# EAGLE design SparkFun Cellular Shield (EAGLE 7.1.0)
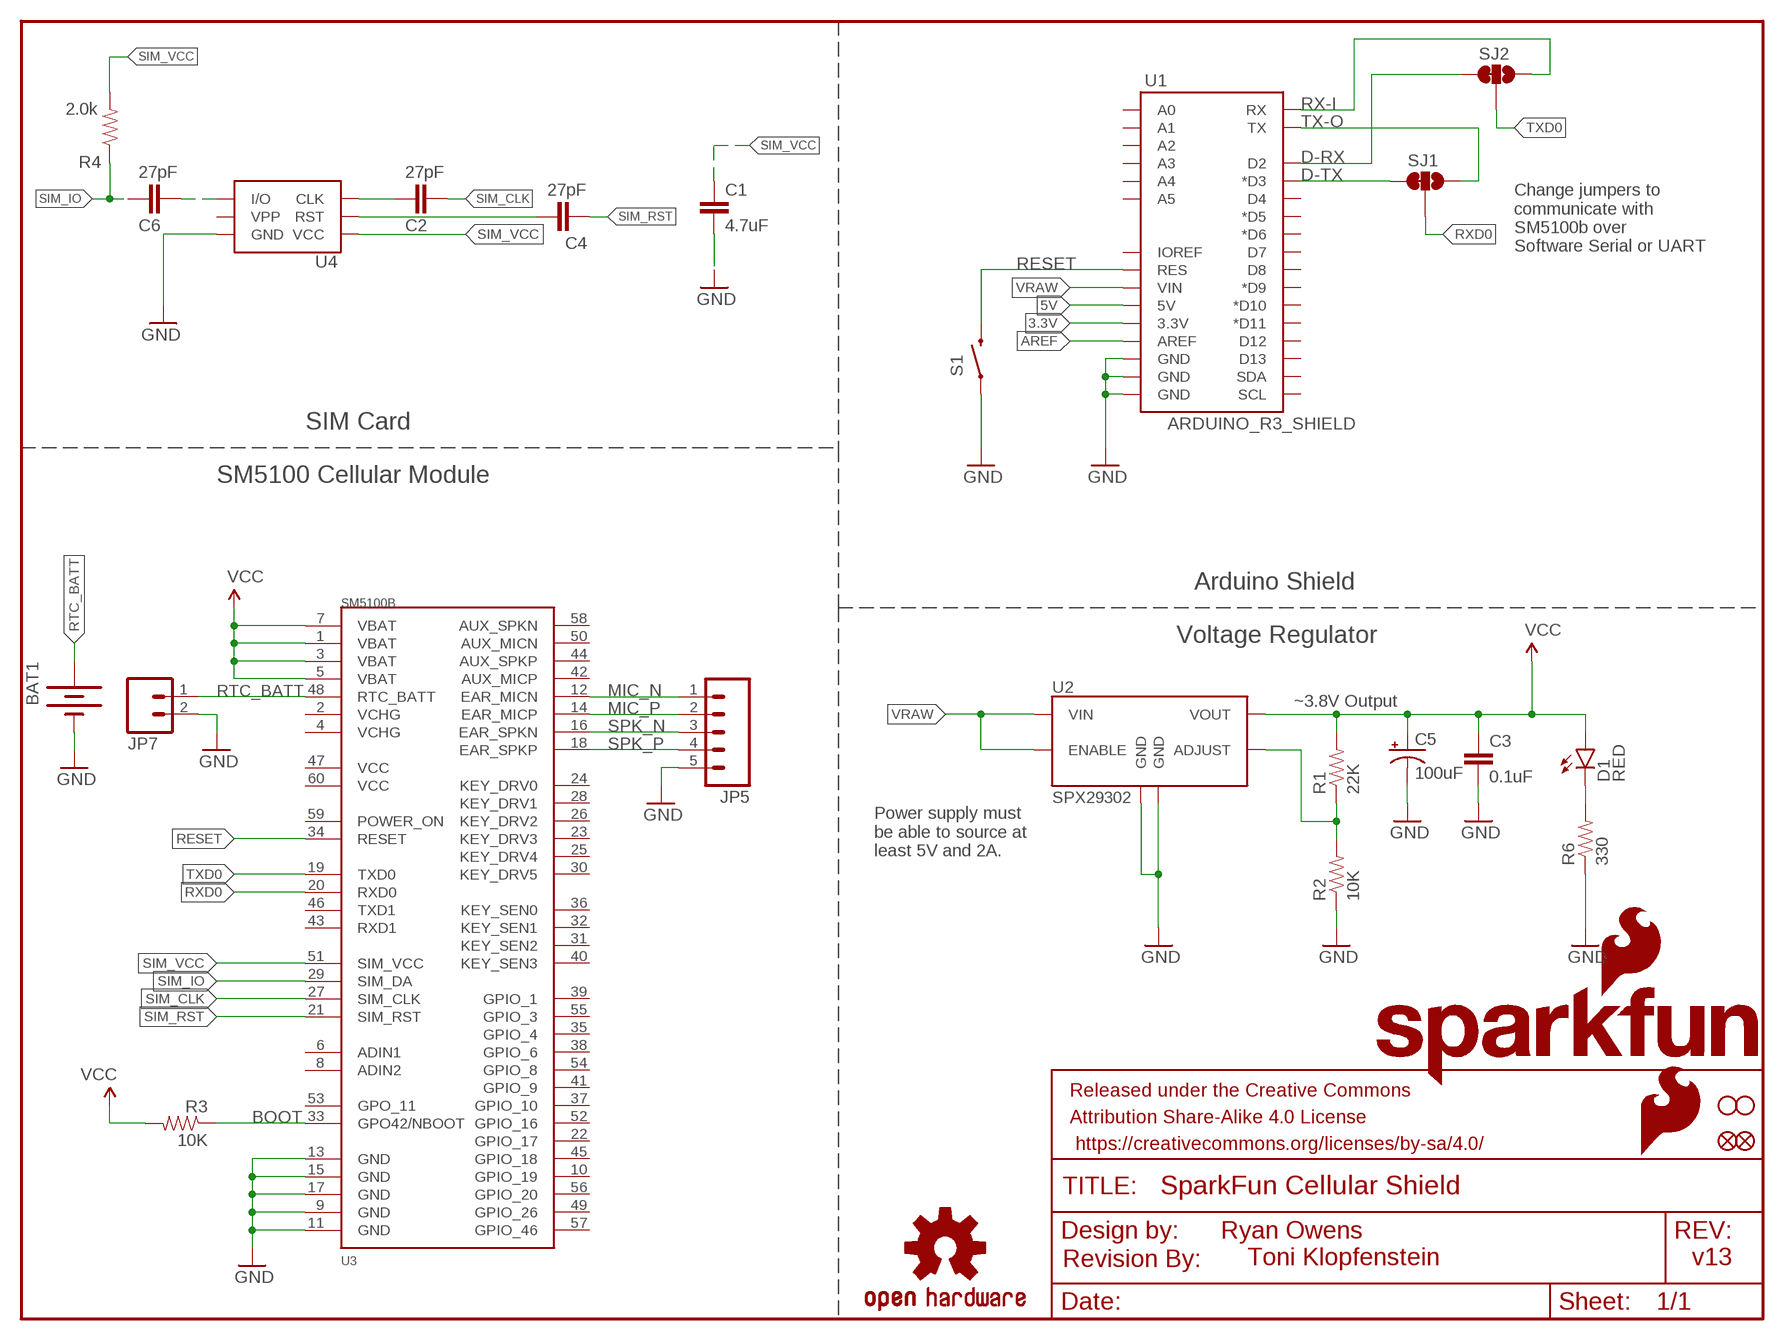
[diagram p0: schematic, sheet 1]

## Parts
BAT1  BATTERY20SMD  [BATTCON_20MM]
C1  4.7uF  4.7UF-6.3V-10%(0603)0603  [0603-CAP]
C2  27pF  27PF50V5%(0603)  [0603-CAP]
C3  0.1uF  0.1UF-25V(+80/-20%)(0603)  [0603-CAP]
C4  27pF  27PF50V5%(0603)  [0603-CAP]
C5  100uF  100UF-10V-10%(TANT)  [EIA7343]
C6  27pF  27PF50V5%(0603)  [0603-CAP]
D1  RED  LED-RED0603  [LED-0603]
FRAME1  FRAME-LETTER  [CREATIVE_COMMONS]
JP1  SFE_LOGO_NAME_FLAME.2_INCH  [SFE_LOGO_NAME_FLAME_.2]
JP2  FIDUCIAL1X2  [FIDUCIAL-1X2]
JP3  FIDUCIAL1X2  [FIDUCIAL-1X2]
JP5  M05PTH  [1X05]
JP7  M02PTH  [1X02]
LOGO1  OSHW-LOGOM  [OSHW-LOGO-M]
LOGO2  SFE_LOGO_FLAME.1_INCH  [SFE_LOGO_FLAME_.1]
R1  22K  22KOHM1/10W1%(0603)  [0603-RES]
R2  10K  10KOHM-1/10W-1%(0603)0603  [0603-RES]
R3  10K  10KOHM-1/10W-1%(0603)0603  [0603-RES]
R4  2.0k  2.0KOHM1/10W5%(0603)  [0603-RES]
R6  330  330OHM1/10W1%(0603)  [0603-RES]
S1  TAC_SWITCHSMD  SWITCH-MOMENTARY-2SMD  [TACTILE-SWITCH-SMD]
SJ1  JUMPER-PAD-3-2OF3_NC_BY_TRACE_SMALL  [PAD-JUMPER-3-2OF3_NC_BY_TRACE_YES_SILK_FULL_BOX]
SJ2  JUMPER-PAD-3-2OF3_NC_BY_TRACE_SMALL  [PAD-JUMPER-3-2OF3_NC_BY_TRACE_YES_SILK_FULL_BOX]
STANDOFF1  STAND-OFF  [STAND-OFF]
STANDOFF2  STAND-OFF  [STAND-OFF]
U1  ARDUINO_R3_SHIELD  [UNO_R3_SHIELD]
U2  SPX29302  [Q5-DD_SPX29300]
U3  SM5100B  [SM5100B]
U4  SIMHOLDERSIM  [SIMHOLDER]
U$1  REVISION  [REVISION]

## Nets
3.3V: U1.3.3V
5V: U1.5V
ADJUST: R1.1 R2.2 U2.5(ADJUST)
AREF: U1.AREF
BOOT: R3.1 U3.33(GPO42/NBOOT)
D-RX: SJ2.3 U1.D2
D-TX: SJ1.3 U1.D3(*D3)
GND: BAT1.2(-) C1.2 C3.2 C5.C(-) JP5.5 JP7.2 R2.1 R6.1 S1.1 U1.GND@0(GND) U1.GND@1(GND) U1.GND@2(GND) U2.3(GND) U2.6(GND) U3.9(GND) U3.11(GND) U3.13(GND) U3.15(GND) U3.17(GND) U4.C5(GND)
MIC_N: JP5.1 U3.12(EAR_MICN)
MIC_P: JP5.2 U3.14(EAR_MICP)
N$1: C6.1 U4.C7(I/O)
N$2: C4.2 U4.C2(RST)
N$3: C2.2 U4.C3(CLK)
N$17: D1.C R6.2
RESET: S1.3 U1.RES U3.34(RESET)
RTC_BATT: BAT1.1(+) JP7.1 U3.48(RTC_BATT)
RX-I: SJ2.1 U1.RX
RXD0: SJ1.2 U3.20(RXD0)
SIM_CLK: C2.1 U3.27(SIM_CLK)
SIM_IO: C6.2 R4.1 U3.29(SIM_DA)
SIM_RST: C4.1 U3.21(SIM_RST)
SIM_VCC: C1.1 R4.2 U3.51(SIM_VCC) U4.C1(VCC)
SPK_N: JP5.3 U3.16(EAR_SPKN)
SPK_P: JP5.4 U3.18(EAR_SPKP)
TX-O: SJ1.1 U1.TX
TXD0: SJ2.2 U3.19(TXD0)
VCC: C3.1 C5.A(+) D1.A R1.2 R3.2 U2.4(VOUT) U3.1(VBAT) U3.3(VBAT) U3.5(VBAT) U3.7(VBAT)
VRAW: U1.VIN U2.1(ENABLE) U2.2(VIN)
Unconnected: U1.A0 U1.A1 U1.A2 U1.A3 U1.A4 U1.A5 U1.D4 U1.D5(*D5) U1.D6(*D6) U1.D7 U1.D8 U1.D9(*D9) U1.D10(*D10) U1.D11(*D11) U1.D12 U1.D13 U1.IOREF U1.SCL U1.SDA U3.2(VCHG) U3.4(VCHG) U3.6(ADIN1) U3.8(ADIN2) U3.10(GPIO_19) U3.22(GPIO_17) U3.23(KEY_DRV3) U3.24(KEY_DRV0) U3.25(KEY_DRV4) U3.26(KEY_DRV2) U3.28(KEY_DRV1) U3.30(KEY_DRV5) U3.31(KEY_SEN2) U3.32(KEY_SEN1) U3.35(GPIO_4) U3.36(KEY_SEN0) U3.37(GPIO_10) U3.38(GPIO_6) U3.39(GPIO_1) U3.40(KEY_SEN3) U3.41(GPIO_9) U3.42(AUX_MICP) U3.43(RXD1) U3.44(AUX_SPKP) U3.45(GPIO_18) U3.46(TXD1) U3.47(VCC) U3.49(GPIO_26) U3.50(AUX_MICN) U3.52(GPIO_16) U3.53(GPO_11) U3.54(GPIO_8) U3.55(GPIO_3) U3.56(GPIO_20) U3.57(GPIO_46) U3.58(AUX_SPKN) U3.59(POWER_ON) U3.60(VCC) U4.C6(VPP)

## Notes on the sheet
- Change jumpers to
  communicate with 
  SM5100b over 
  Software Serial or UART
- SIM Card
- SM5100 Cellular Module
- Arduino Shield
- Voltage Regulator
- ~3.8V Output
- Power supply must 
  be able to source at
  least 5V and 2A.
- Ryan Owens
- Toni Klopfenstein | v13

## Library data of the parts
BAT1 = SparkFun-Electromechanical:BATTERY: Battery Holders Various common sizes : AA, AAA, 18650 (PRT-12895), 20mm coin cell and 12mm coin cell. 20MM_4LEGS, BATT-10373
C1 = SparkFun-Capacitors:4.7UF-6.3V-10%(0603): CAP-08280; PROD_ID: CAP-08280
C2 C4 C6 = SparkFun-Capacitors:27PF50V5%(0603): CAP-09989; PROD_ID: CAP-09989
C3 = SparkFun-Capacitors:0.1UF-25V(+80/-20%)(0603): CAP-00810 Ceramic Standard decoupling cap; PROD_ID: CAP-00810
C5 = SparkFun-Capacitors:100UF-10V-10%(TANT): CAP-07890; PROD_ID: CAP-07890
D1 = SparkFun-LED:LED-RED: Assorted Red LEDs LilyPad 1206- DIO-09912 1206- DIO-00809 0603- DIO-00819; PROD_ID: DIO-00819
FRAME1 = SparkFun-Aesthetics:FRAME-LETTER: Schematic Frame Standard 8.5x11 US Letter frame
JP1 = SparkFun-Aesthetics:SFE_LOGO_NAME_FLAME: SFE Logo, name and flame This is the SparkFun full logo. The logo on the schematic will always be the same size; the package variant is the height of the flame part of the logo. Default layer for the logo on the board is tSilk.
JP2 JP3 = SparkFun-Aesthetics:FIDUCIAL: Fiducial Alignment Points Various fiducial points for machine vision alignment.
JP5 = SparkFun-Connectors:M05: Header 5 Standard 5-pin 0.1" header. Use with straight break away headers (SKU : PRT-00116), right angle break away headers (PRT-00553), swiss pins (PRT-00743), machine pins (PRT-00117), and female headers (PRT-00115). Molex polarized connector foot print use with SKU : PRT-08230 with associated crimp pins and housings.
JP7 = SparkFun-Connectors:M02: Standard 2-pin 0.1" header. Use with - straight break away headers ( PRT-00116) - right angle break away headers (PRT-00553) - swiss pins (PRT-00743) - machine pins (PRT-00117) - female headers (PRT-00115) Molex polarized connector foot print use with: PRT-08233 with associated crimp pins and housings. 2.54_SCREWTERM for use with PRT-10571. 3.5mm Screw Terminal footprints for PRT-08084 5mm Screw Terminal footprints for use with PRT-08432
LOGO1 = SparkFun-Aesthetics:OSHW-LOGO: Open Source Hardware Logo This logo indicates the piece of hardware it is found on incorporates a OSHW license and/or adheres to the definition of open source hardware found here: http://freedomdefined.org/OSHW
LOGO2 = SparkFun-Aesthetics:SFE_LOGO_FLAME: SFE Logo, flame only This is the SparkFun flame logo. The logo on the schematic will always be the same size; the package variant is the height of the flame. Default layer for the logo on the board is tSilk.
R1 = SparkFun-Resistors:22KOHM1/10W1%(0603): RES-07853; PROD_ID: RES-07853
R2 R3 = SparkFun-Resistors:10KOHM-1/10W-1%(0603): RES-00824; PROD_ID: RES-00824
R4 = SparkFun-Resistors:2.0KOHM1/10W5%(0603): RES-08296; PROD_ID: RES-08296
R6 = SparkFun-Resistors:330OHM1/10W1%(0603): RES-00818; PROD_ID: RES-00818
S1 = SparkFun-Electromechanical:SWITCH-MOMENTARY-2: Various NO switches- pushbuttons, reed, etc; PROD_ID: SWCH-08247
SJ1 SJ2 = SparkFun-Passives:JUMPER-PAD-3-2OF3_NC_BY_TRACE
STANDOFF1 STANDOFF2 = SparkFun-Electromechanical:STAND-OFF: #4 Stand Off This is the mechanical footprint for a #4 phillips button head screw. Use the keepout ring to avoid running the screw head into surrounding components. SKU : PRT-00447
U1 = SparkFun-Boards:ARDUINO_R3_SHIELD: Shield form compatible with the Arduino Uno R3.
U2 = SparkFun-PowerIC:SPX29302: 3A LDO regulator; PROD_ID: VREG-08337
U3 = SparkFun-RF:SM5100B: Quad-band GSM modem; PROD_ID: CONN-09315
U4 = SparkFun-Connectors:SIMHOLDER: SIM Socket Socket for SIM cellular cards. Schematic element and footprint production proven. Spark Fun Electronics SKU : PRT-00548; PROD_ID: CONN-08536
U$1 = SparkFun-Aesthetics:REVISION

## Net classes
0 default: width 0.203 mm

## Board
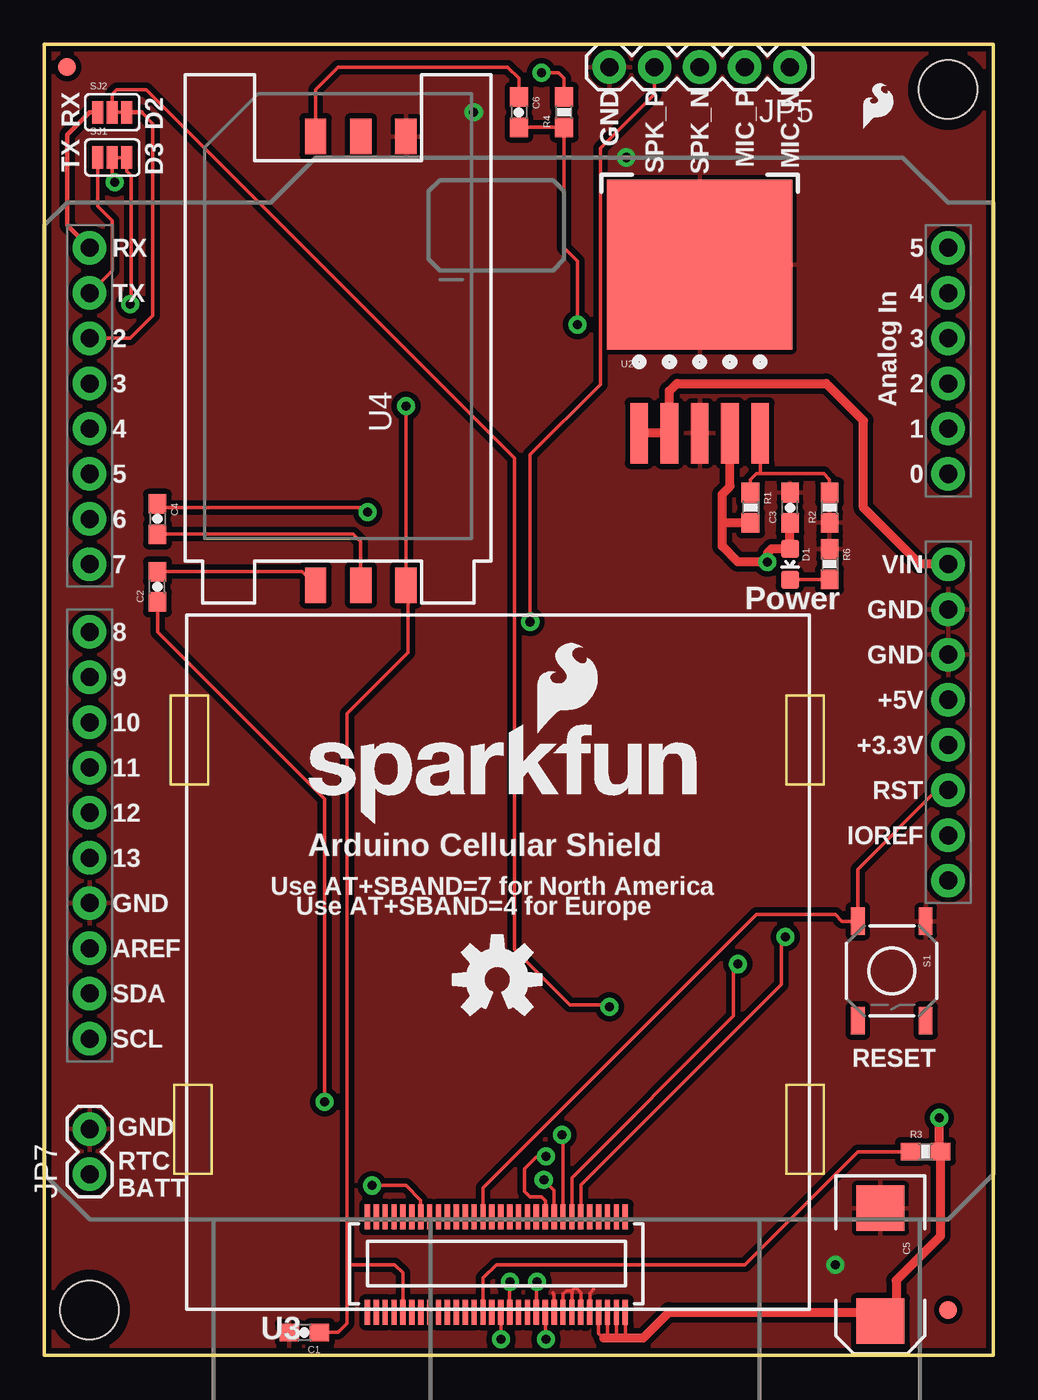
[diagram p1: board, top side]
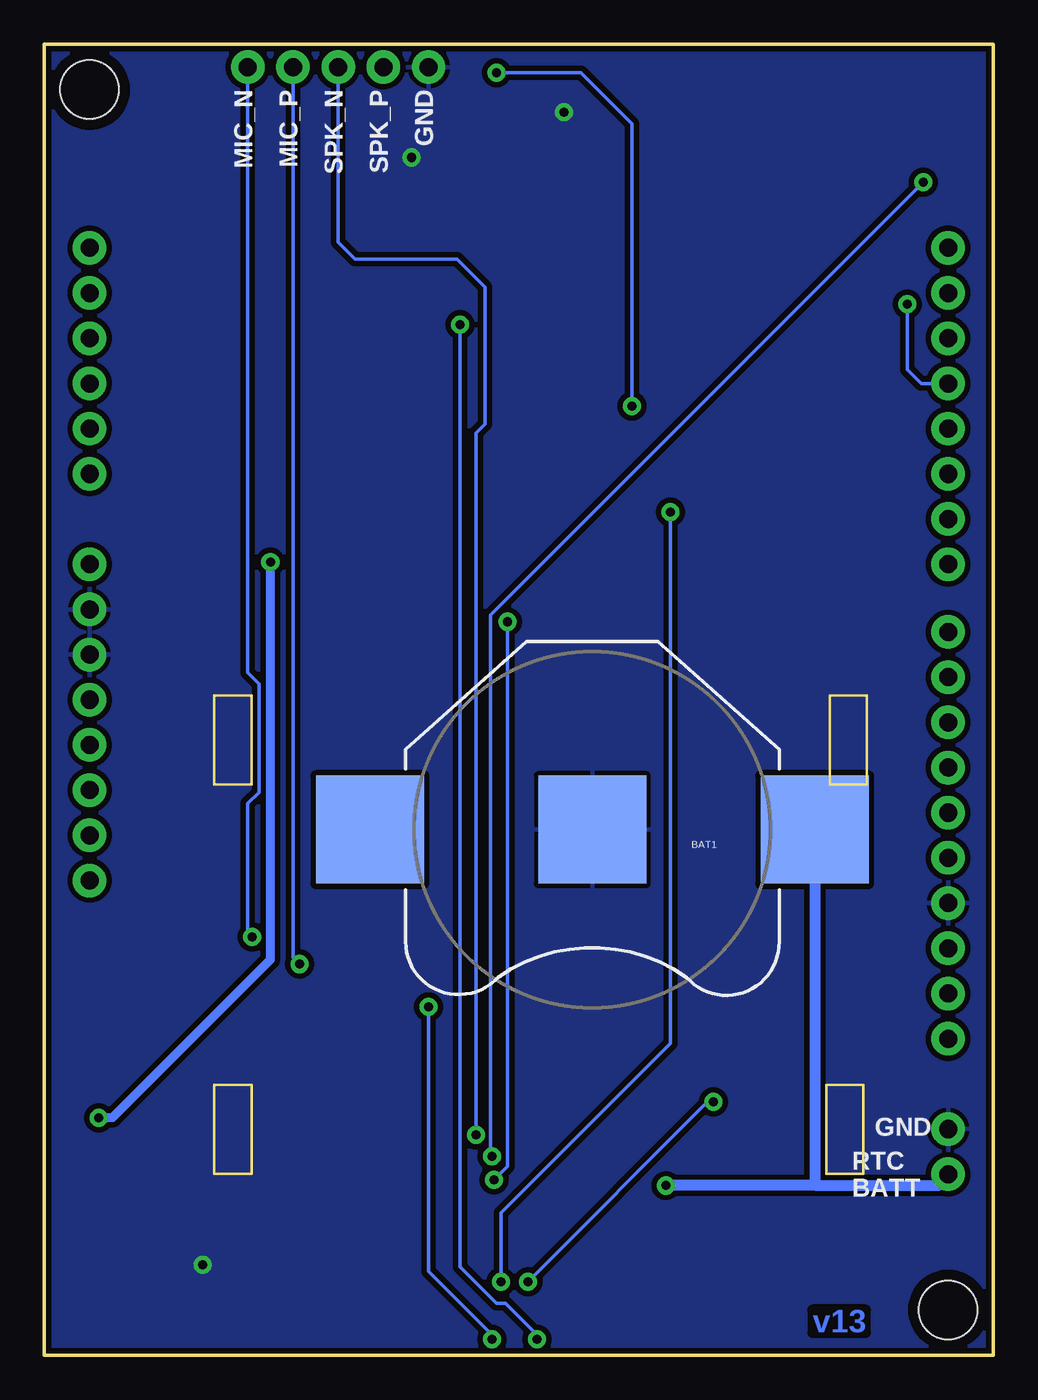
[diagram p2: board, bottom side, seen from below]

Size 53.34 x 73.66 mm. Coordinates in mm from the lower left corner, seen from the top.
Outline: 0,0 53.34,0 53.34,73.66 0,73.66 0,0
Copper layers (1*16): Top 0.035mm / dielectric 1.5mm / Bottom 0.035mm
Design rules "SparkFun-2-layer": minimum track width 7mil, minimum drill 15mil, track to track 8mil, track to pad 8mil, pad to pad 8mil, via to via 8mil, smd to smd 8mil, copper to edge 8mil, drill to drill 8mil, minimum pad ring 12mil, minimum via ring 10mil, stop-mask expansion 4mil, vias tented up to drill 20mil, thermal gap 10mil

### Footprints (pad centres in the part's own frame; a part is rotated, then mirrored left to right if it is on the bottom)
BATTCON_20MM = smd 6.07 x 6.07: 1 -12.5,0; 2 0,0; 3 12.5,0
0603-CAP = smd 1.1 x 1: 1 -0.85,0; 2 0.85,0
EIA7343 = smd 2.55 x 2.7: A 3.17,0; C -3.17,0
LED-0603 = smd 1 x 1: A 0,-0.877; C 0,0.877
FIDUCIAL-1X2 = smd 1 x 1: 1 0,0
1X05 = drill 1.016 pad 1.88: 1 0,0; 2 2.54,0; 3 5.08,0; 4 7.62,0; 5 10.16,0
1X02 = drill 1.016 pad 1.88: 1 0,0; 2 2.54,0
0603-RES = smd 1.1 x 1: 1 -0.85,0; 2 0.85,0
TACTILE-SWITCH-SMD = smd 1.524 x 0.762: 1 -2.794,1.905; 2 2.794,1.905; 3 -2.794,-1.905; 4 2.794,-1.905
PAD-JUMPER-3-2OF3_NC_BY_TRACE_YES_SILK_FULL_BOX = smd 0.635 x 1.27: 1 -0.813,0; 2 0,0; 3 0.813,0
STAND-OFF = hole 3.302: 0,0
UNO_R3_SHIELD = drill 1.016 pad 1.88: 3.3V 50.8,26.67; 5V 50.8,29.21; A0 50.8,41.91; A1 50.8,44.45; A2 50.8,46.99; A3 50.8,49.53; A4 50.8,52.07; A5 50.8,54.61; AREF 2.54,15.24; D2 2.54,49.53; D3 2.54,46.99; D4 2.54,44.45; D5 2.54,41.91; D6 2.54,39.37; D7 2.54,36.83; D8 2.54,33.02; D9 2.54,30.48; D10 2.54,27.94; D11 2.54,25.4; D12 2.54,22.86; D13 2.54,20.32; GND@0 50.8,31.75; GND@1 50.8,34.29; GND@2 2.54,17.78; IOREF 50.8,21.59; NC 50.8,19.05; RES 50.8,24.13; RX 2.54,54.61; SCL 2.54,10.16; SDA 2.54,12.7; TX 2.54,52.07; VIN 50.8,36.83
Q5-DD_SPX29300 = smd 1 x 3.4: 1 -3.4,-7.875; 2 -1.7,-7.875; 3 0,-7.875; 4 1.7,-7.875; 5 3.4,-7.875 | smd 10.414 x 9.525: 6 0,1.595
SM5100B = smd 0.3 x 1.4: 1 7.25,-2.68; 2 7.25,2.68; 3 6.75,-2.68; 4 6.75,2.68; 5 6.25,-2.68; 6 6.25,2.68; 7 5.75,-2.68; 8 5.75,2.68; 9 5.25,-2.68; 10 5.25,2.68; 11 4.75,-2.68; 12 4.75,2.68; 13 4.25,-2.68; 14 4.25,2.68; 15 3.75,-2.68; 16 3.75,2.68; 17 3.25,-2.68; 18 3.25,2.68; 19 2.75,-2.68; 20 2.75,2.68; 21 2.25,-2.68; 22 2.25,2.68; 23 1.75,-2.68; 24 1.75,2.68; 25 1.25,-2.68; 26 1.25,2.68; 27 0.75,-2.68; 28 0.75,2.68; 29 0.25,-2.68; 30 0.25,2.68; 31 -0.25,-2.68; 32 -0.25,2.68; 33 -0.75,-2.68; 34 -0.75,2.68; 35 -1.25,-2.68; 36 -1.25,2.68; 37 -1.75,-2.68; 38 -1.75,2.68; 39 -2.25,-2.68; 40 -2.25,2.68; 41 -2.75,-2.68; 42 -2.75,2.68; 43 -3.25,-2.68; 44 -3.25,2.68; 45 -3.75,-2.68; 46 -3.75,2.68; 47 -4.25,-2.68; 48 -4.25,2.68; 49 -4.75,-2.68; 50 -4.75,2.68; 51 -5.25,-2.68; 52 -5.25,2.68; 53 -5.75,-2.68; 54 -5.75,2.68; 55 -6.25,-2.68; 56 -6.25,2.68; 57 -6.75,-2.68; 58 -6.75,2.68; 59 -7.25,-2.68; 60 -7.25,2.68
SIMHOLDER = smd 2 x 1.2: C1 -12.61,-3.81; C2 -12.61,-1.27; C3 -12.61,1.27; C5 12.61,-3.81; C6 12.61,-1.27; C7 12.61,1.27

### Placement (x,y rotation side)
BAT1  22.54,29.53 180 bottom
C1  14.61,1.27 180 top
C2  6.35,43.18 90 top
C3  41.91,47.62 90 top
C4  6.35,46.99 270 top
C5  46.99,5.08 270 top
C6  26.67,69.85 270 top
D1  41.91,44.45 180 top
FRAME1  0.1,-15.24 0 top  (outside the outline)
JP1  14.15,29.74 0 top
JP2  1.27,72.39 0 top
JP3  50.8,2.54 0 top
JP5  41.91,72.39 180 top
JP7  2.54,10.16 90 top
LOGO1  25.45,21.09 0 top
LOGO2  45.72,68.58 0 top
R1  39.69,47.62 270 top
R2  44.13,47.62 90 top
R3  49.53,11.43 0 top
R4  29.21,69.85 90 top
R6  44.13,44.45 270 top
S1  47.62,21.59 270 top
SJ1  3.81,67.31 0 top
SJ2  3.81,69.85 0 top
STANDOFF1  2.54,2.54 0 top
STANDOFF2  50.8,71.12 0 top
U1  0,7.62 0 top
U2  36.83,59.69 0 top
U3  25.4,5.08 0 top
U4  16.51,55.88 90 top
U$1  11.43,-17.78 0 top  (outside the outline)

### Tracks (layer width: path | path; a pad name or v marks a point on that pad's centre or on a via)
ADJUST
  Top 0.203: R1.1 39.69,49.21 40.01,49.53 40.32,49.53 | 40.32,49.53 43.81,49.53 44.13,49.21 R2.2 | U2.5 40.23,49.62 40.32,49.53
BOOT
  Top 0.203: R3.1 45.72,11.43 39.37,5.08 25.4,5.08 24.65,4.33 U3.33
D-RX
  Top 0.203: 5.46,69.85 6.1,69.22 6.1,58.42 4.83,57.15 U1.D2
  Top 0.254: SJ2.3 5.46,69.85
D-TX  (via drill 0.51)
  Top 0.203: SJ1.3 4.62,66.55 4.88,66.29 4.88,59.11 v4.83,59.05
  Bottom 0.203: v4.83,59.05 4.83,55.37 4.06,54.61 U1.D3
GND  (via drill 0.51)
  Top 0.203: 30.86,3.68 30.65,3.47 U3.9 | U3.17 28.65,3.42 28.57,3.49 | U3.15 29.15,3.43 29.33,3.62 29.65,3.62 | U3.13 29.65,3.62 | 29.65,3.62 29.84,3.81 30.15,3.5 U3.11
  other vias: 44.45,5.08 24.13,69.85 32.7,67.31
  pour Top (isolate 0.305): 0,0 0,73.66 53.34,73.66 53.34,0
  pour Bottom (isolate 0.305): 0,0 0,73.66 53.34,73.66 53.34,0
MIC_N  (via drill 0.51)
  Top 0.203: U3.12 30.15,9.56 41.41,20.82 41.41,23.25 v41.66,23.5
  Bottom 0.203: JP5.1 41.91,38.35 41.27,37.72 41.27,31.62 41.91,30.99 41.91,23.75 v41.66,23.5
MIC_P  (via drill 0.51)
  Top 0.203: U3.14 29.65,9.96 38.73,19.05 38.73,21.72 v38.99,21.97
  Bottom 0.203: JP5.2 39.37,22.35 v38.99,21.97
N$1
  Top 0.203: U4.C7 15.24,71.12 16.51,72.39 26.04,72.39 26.67,71.75 C6.1
N$2
  Top 0.203: C4.2 17.36,46.14 17.78,45.72 U4.C2
N$3
  Top 0.203: C2.2 14.48,44.03 U4.C3
N$17
  Top 0.203: R6.2 41.94,43.6 D1.C
RESET
  Top 0.203: U3.34 24.65,9.41 40.01,24.77 44.45,24.77 44.83,24.38 S1.3 45.72,27.3 50.16,31.75 U1.RES
RTC_BATT  (via drill 0.51)
  Top 0.203: v18.41,9.53 20.32,9.53 21.15,8.7 U3.48
  Bottom 0.61: BAT1.1 10.04,9.64 9.93,9.53 | 9.93,9.53 v18.41,9.53 | 9.93,9.53 3.11,9.53 3.11,9.59 JP7.1
RX-I
  Top 0.254: U1.RX 1.27,63.5 1.27,68.58 2.54,69.85 SJ2.1
RXD0  (via drill 0.51)
  Top 0.203: SJ1.2 3.81,66.04 v3.94,65.91 | U3.20 28.15,8.68 27.94,8.89 27.3,8.89 26.99,9.21 26.99,10.48 27.62,11.11 28.13,11.11 v28.19,11.18
  Bottom 0.203: v3.94,65.91 28.26,41.59 28.26,11.24 v28.19,11.18
SIM_CLK  (via drill 0.51)
  Top 0.203: v15.75,14.22 15.75,31.24 6.35,40.64 C2.1 | U3.27 26.15,4.12 v26.16,4.13
  Bottom 0.203: v15.75,14.22 16.07,14.22 v26.16,4.13
SIM_IO  (via drill 0.51)
  Top 0.203: C6.2 R4.1 29.21,62.23 29.97,61.47 v29.97,57.91 | U3.29 v25.65,0.89
  Bottom 0.203: v25.65,0.89 25.65,1.14 27.43,2.92 27.94,2.92 29.97,4.95 v29.97,57.91
SIM_RST  (via drill 0.51)
  Top 0.203: C4.1 6.57,47.62 17.91,47.62 v18.16,47.37 | U3.21 27.65,4.09 v27.69,4.13
  Bottom 0.203: v27.69,4.13 27.69,8 18.16,17.53 v18.16,47.37
SIM_VCC  (via drill 0.51)
  Top 0.203: 17.02,4.95 17.02,36.07 20.45,39.5 20.45,43.14 U4.C1 v20.32,53.34 | C1.1 16.51,1.27 17.02,1.78 17.02,4.95 | R4.2 29.21,71.75 28.89,72.07 v27.94,72.07 | U3.51 20.15,4.62 19.68,5.08 17.14,5.08 17.02,4.95
  Bottom 0.203: v20.32,53.34 20.32,69.22 23.18,72.07 v27.94,72.07
SPK_N  (via drill 0.51)
  Top 0.203: U3.16 29.15,12.32 v29.08,12.38
  Bottom 0.203: v29.08,12.38 29.08,51.82 28.57,52.32 28.57,60.01 30.16,61.59 35.88,61.59 36.83,62.55 JP5.3
SPK_P  (via drill 0.51)
  Top 0.203: v27.3,41.21 27.3,50.61 31.24,54.55 31.24,67.82 34.29,70.87 JP5.4 | U3.18 28.65,9.26 v28.07,9.84
  Bottom 0.203: v27.3,41.21 27.3,10.6 v28.07,9.84
TX-O
  Top 0.203: U1.TX 3.81,60.96 3.81,63.75 3,64.57 SJ1.1
TXD0  (via drill 0.51)
  Top 0.203: SJ2.2 3.81,70.87 4.06,71.12 5.71,71.12 26.42,50.42 26.42,22.8 29.53,19.68 31.62,19.68 v31.75,19.56 | U3.19 28.15,0.93 v28.19,0.89
  Bottom 0.203: v31.75,19.56 31.75,4.7 28.19,1.14 v28.19,0.89
VCC  (via drill 0.51)
  Top 0.203: 38.48,48.77 38.53,48.82 38.53,48.85 | 49.91,6.22 50.04,6.35 | U3.3 32.15,1.03 32.07,0.95 31.75,0.95 31.65,1.05 | U3.1 32.65,1 32.7,0.95 | U3.7 31.15,1.24 31.43,0.95 31.55,0.95 31.65,1.05 | U3.5 31.65,1.05 | 50.29,11.94 50.29,11.52 R3.2
  Top 0.508: 49.91,6.22 47.88,4.19 47.88,2.8 47.49,2.41 | 50.29,11.94 v50.29,13.34 | v40.64,44.58 38.99,44.58 38.1,45.47 38.1,46.67 | 38.1,46.67 38.1,48.39 38.48,48.77 | R3.2 50.38,6.69 50.04,6.35 | 38.1,46.67 38.2,46.77 R1.2 | 40.77,44.45 v40.64,44.58 | 31.43,0.95 31.75,0.95 32.7,0.95 33.66,0.95 35.12,2.41 47.49,2.41 | v40.64,44.58 40.64,45.09 40.88,45.33 D1.A C3.1 | 38.53,48.85 U2.4 | C5.A 47.49,2.41
  Bottom 0.508: v40.64,44.58 40.64,22.23 49.53,13.34 v50.29,13.34
VRAW
  Top 0.203: 43.94,54.61 44.07,54.48 | U2.2 34.8,51.81 34.8,51.82 34.8,51.81
  Top 0.508: U2.2 35.13,54.18 35.56,54.61 43.94,54.61 | 34.8,51.81 U2.1 | U1.VIN 49.21,44.45 46.04,47.62 46.04,52.51 44.07,54.48

### Text on the board
Bottom: v13
tPlace: D2 | GND | GND | SPK_P | SPK_N | MIC_P | MIC_N | RX | D3 | TX | Power | Arduino Cellular Shield | Use AT+SBAND=7 for North America | Use AT+SBAND=4 for Europe | RESET | GND | RTC / BATT
bPlace: GND | SPK_P | SPK_N | MIC_P | MIC_N | GND | RTC / BATT
tDocu: Ryan Owens | Toni Klopfenstein